# Altium schematic sheet 7A SCR BASED SSS SOLAR CHARGE CONTROL.SchDoc
size A4; SheetNumber: 1; SheetTotal: 1
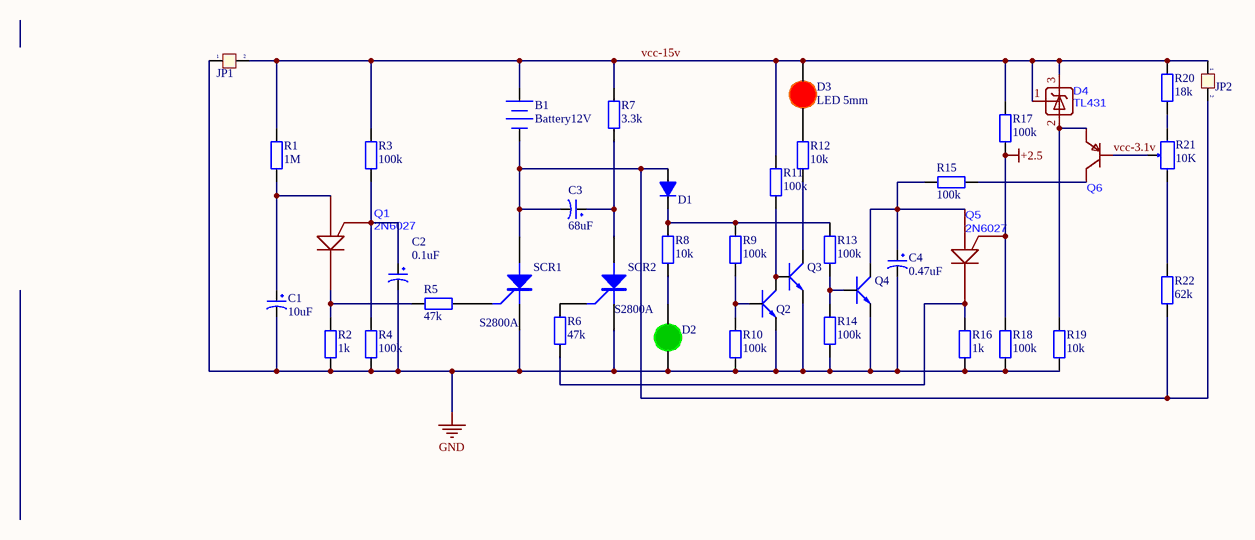
[diagram p0: 7A SCR BASED SSS SOLAR CHARGE CONTROL.SchDoc]

## Parts
B1  Battery12V  [HDR1X2]
C1  10uF  [tu hoa 4mm]
C2  0.1uF  [tu hoa 5mm]
C3  68uF  [tu hoa 18mm]
C4  0.47uF  [tu hoa 5mm]
D1  100v  [DIODE 1A]  (value not drawn)
D2  (no value)  [LED-5MM-Green]
D3  LED 5mm  [LED-5MM-RED]
D4  TL431  [TO-92-3_L4.9-W3.7-P1.27-L]
JP1  Jumper 2  [J2]  (value not drawn)
JP2  Jumper 2  [J2]  (value not drawn)
Q1  2N6027  [TO92-INLINE - duplicate]
Q2  (no value)  [TO92]
Q3  (no value)  [TO92]
Q4  (no value)  [TO92]
Q5  2N6027  [TO92-INLINE - duplicate]
Q6  (no value)  [TO-92-3_L4.9-W3.7-P1.27-L]
R1  1M  [tro vach 1/4w]
R2  1k  [tro vach 1/4w]
R3  100k  [tro vach 1/4w]
R4  100k  [tro vach 1/4w]
R5  47k  [tro vach 1/4w]
R6  47k  [tro vach 1/4w]
R7  3.3k  [tro vach 1/4w]
R8  10k  [tro vach 1/4w]
R9  100k  [tro vach 1/4w]
R10  100k  [tro vach 1/4w]
R11  100k  [tro vach 1/4w]
R12  10k  [tro vach 1/4w]
R13  100k  [tro vach 1/4w]
R14  100k  [tro vach 1/4w]
R15  100k  [tro vach 1/4w]
R16  1k  [tro vach 1/4w]
R17  100k  [tro vach 1/4w]
R18  100k  [tro vach 1/4w]
R19  10k  [tro vach 1/4w]
R20  18k  [tro vach 1/4w]
R21  10K  [Bien Tro Vi Chinh Dung]
R22  62k  [tro vach 1/4w]
SCR1  S2800A  [TO92-INLINE - duplicate]
SCR2  S2800A  [TO92-INLINE - duplicate]

## Nets
+2.5: Q5.2(G) R17.1 R18.2
GND: C1.2 C2.2 C4.2 D2.2(K) JP1.1 Q2.1(E) Q3.1(E) Q4.1(E) R2.1 R4.1 R10.1 R14.1 R16.1 R18.1 R19.1 SCR1.2(K) SCR2.2(K)
vcc-3.1v: Q6.2 R21.2
vcc-15v: B1.1(+) D3.1(A) D4.1(R) D4.3(K) JP1.2 JP2.1 R1.2 R3.2 R7.2 R11.2 R17.2 R20.2
NetB1_2: B1.2(-) C3.2 D1.1(A) JP2.2 R22.1 SCR1.1(A)
NetC1_1: C1.1 Q1.1(A) R1.1
NetC2_1: C2.1 Q1.2(G) R3.1 R4.2
NetC3_1: C3.1 R7.1 SCR2.1(A)
NetC4_1: C4.1 Q4.3(C) Q5.1(A) R15.2
NetD1_2: D1.2(K) R8.2 R9.2 R13.2
NetD2_1: D2.1(A) R8.1
NetD3_2: D3.2(K) R12.2
NetD4_2: D4.2(A) Q6.1 R19.2
NetQ1_3: Q1.3(K) R2.2 R5.1
NetQ2_2: Q2.2(B) R9.1 R10.2
NetQ2_3: Q2.3(C) Q3.2(B) R11.1
NetQ3_3: Q3.3(C) R12.1
NetQ4_2: Q4.2(B) R13.1 R14.2
NetQ5_3: Q5.3(K) R6.1 R16.2
NetQ6_3: Q6.3 R15.1
NetR5_2: R5.2 SCR1.3(G)
NetR6_2: R6.2 SCR2.3(G)
NetR20_1: R20.1 R21.3
NetR21_1: R21.1 R22.2

## Library data of the parts
B1 = Battery9V: Multicell Battery; Published: 24-Mar-1999; LatestRevisionDate: 17-Jul-2002; LatestRevisionNote: Re-released for DXP Platform.; PackageReference: BAT-2; Publisher: Altium Limited
C1 = Tu Hoa 10uF 16V 4x7: Cắm; So_Chan: 2; Don_Vi: Con; Ten_Linh_Kien: Tụ Hóa 10uF 16V; Ma_Hang: MH006855; Chung_Loai: Cắm; Kieu_Chan: *
C2 = Tu Hoa 0.1uF 50V 5x11: Cắm; Don_Vi: Con; So_Chan: 2; Ten_Linh_Kien: Tụ Hóa 0.1uF 50V; Ma_Hang: MH006853; Chung_Loai: Cắm; Kieu_Chan: *
C3 = Tu Hoa 68uF 400V 18x26: Cắm; Don_Vi: Con; So_Chan: 2; Ma_Hang: MH007269; Ten_Linh_Kien: Tụ Hóa 68uF 400V; Chung_Loai: Cắm; Kieu_Chan: *
C4 = Tu Hoa 0.47uF 50V 5x11: Cắm; Don_Vi: Con; So_Chan: 2; Ten_Linh_Kien: Tụ Hóa 0.47uF50V 5x11MM; Ma_Hang: MH006969; Chung_Loai: Cắm; Kieu_Chan: *
D1 = Diode 1N4007: Cắm; Ten_Linh_Kien: Diode 1N4007 1A (DIP); Don_Vi: Con; Ma_Hang: MH001063; Ghi Chu: *; Kieu_Chan: *; Chung_Loai: Cắm
D2 = LED 5mm Xanh La: Cắm; Don_Vi: Con; Ma_Hang: MH008969; Ten_Linh_Kien: LED 5MM Phủ Xanh (1000c); Ghi_Chu: *; Kieu_Chan: *; Chung_Loai: Cắm
D3 = LED 5mm Do: Cắm; Don_Vi: Con; Ma_Hang: MH008967; Ten_Linh_Kien: Led 5MM Phủ Đỏ (1000c); Ghi_Chu: *; Kieu_Chan: *; Chung_Loai: Cắm
D4 = TL431CLPMTL431CLPM
JP1 JP2 = JP 2_1: Value: JP 2
Q2-Q4 = Trans 2N3904: NPN transistor EBC; Value: C9014
Q5 = 2N6027RLRA_YK
Q6 = 2N3906
R1 = Tro Vach 1/4W 5% 1M: Cắm; So_Chan: 2; Don_Vi: Con; Ten_Linh_Kien: Trở Vạch 1/4w 5% 1M; Ma_Hang: MH007392; Chung_Loai: Cắm; Kieu_Chan: *
R2 R16 = Tro Vach 1/4W 5% 1k: Cắm; Don_Vi: Con; So_Chan: 2; Ten_Linh_Kien: Trở Vạch 1/4w 5% 1k; Ma_Hang: MH007390; Chung_Loai: Cắm; Kieu_Chan: *
R3 R4 R9-R11 R13-R15 R17 R18 = Tro Vach 1/4W 5% 100k: Cắm; Don_Vi: Con; So_Chan: 2; Ten_Linh_Kien: Trở Vạch 1/4w 5% 100k; Ma_Hang: MH007352; Chung_Loai: Cắm; Kieu_Chan: *
R5 R6 = Tro Vach 1/4W 5% 47k: Cắm; Don_Vi: Con; So_Chan: 2; Ten_Linh_Kien: Trở Vạch 1/4w 5% 47k; Ma_Hang: MH004982; Chung_Loai: Cắm; Kieu_Chan: *
R7 = Tro Vach 1/4W 5% 3.3k: Cắm; Don_Vi: Con; So_Chan: 2; Ten_Linh_Kien: Trở vạch 1/4w 5% 3.3k; Ma_Hang: MH007306; Chung_Loai: Cắm; Kieu_Chan: *
R8 R12 R19 = Tro Vach 1/4W 5% 10k: Căm; Chung_Loai: Cắm; Don_Vi: Con; So_Chan: 2; Ten_Linh_Kien: Trở Vạch 1/4w 5% 10K; Ma_Hang: MH007354; Kieu_Chan: *
R20 = Tro Vach 1/4W 5% 18k: Cắm; Don_Vi: Con; So_Chan: 2; Ten_Linh_Kien: Trở Vạch 1/4w 5% 18k; Ma_Hang: MH007291; Chung_Loai: Cắm; Kieu_Chan: *
R21 = Bien Tro Tinh Chinh 10K Dung: Cắm; Ma_Hang: MH003232; Ten_Linh_Kien: Biến Trở VR 103-10K 3296W; Don_Vi: Con; Kieu_Chan: *; Chung_Loai: Cắm; Ghi_Chu: *
R22 = Tro Vach 1/4W 5% 68k: Cắm; Don_Vi: Con; So_Chan: 2; Ten_Linh_Kien: Trở Vạch 1/4w 5% 68k; Ma_Hang: MH007332; Kieu_Chan: *; Chung_Loai: Cắm
SCR1 SCR2 = SCR